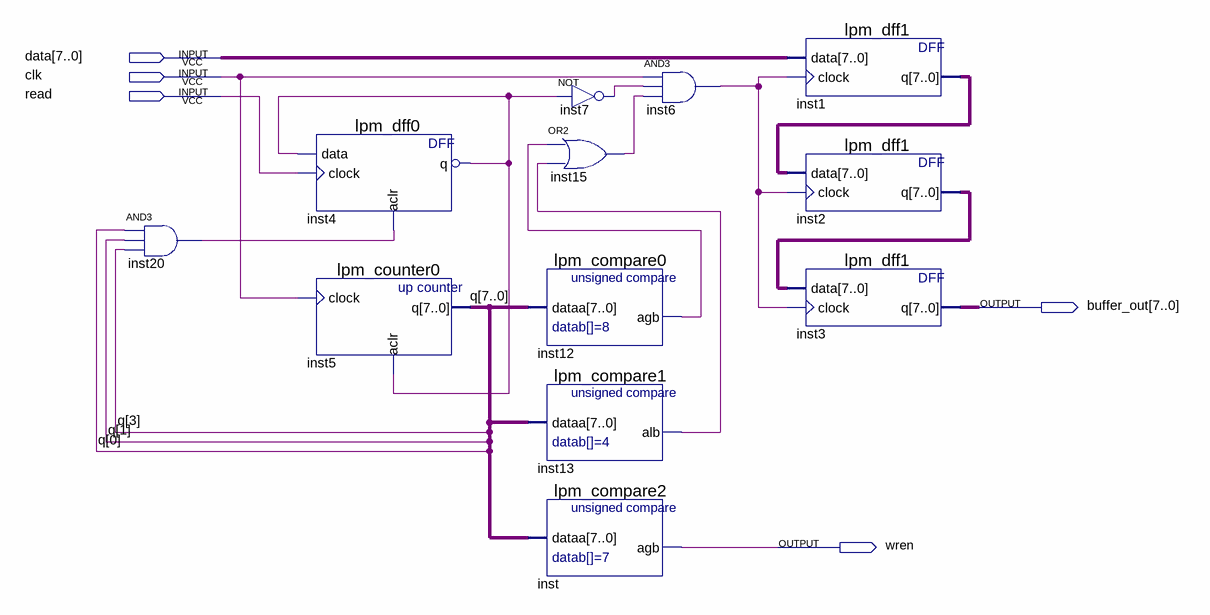
[diagram p0: schematic sheet]
// Quartus schematic buffer.bdf as structural Verilog: 12 symbols, 5 pins
module buffer (
  input  [7:0] data,
  input  clk,
  input  read,
  output [7:0] buffer_out,
  output wren
);

  wire inst4_q, inst4_q_inverted_out, inst6_out, inst7_out, inst12_agb, inst13_alb, inst15_out, inst20_out;
  wire [7:0] inst1_q, inst2_q, q;

  and inst20 (inst20_out, q[0], q[1], q[3]);
  lpm_dff0 inst4 (.data(inst4_q_inverted_out), .clock(read), .aclr(inst20_out), .q(inst4_q));
  not inst4_q_inverted (inst4_q_inverted_out, inst4_q);
  lpm_counter0 inst5 (.clock(clk), .aclr(inst4_q_inverted_out), .q(q));
  not inst7 (inst7_out, inst4_q_inverted_out);
  or inst15 (inst15_out, inst12_agb, inst13_alb);
  lpm_compare0 inst12 (.dataa(q), .agb(inst12_agb));
  lpm_compare1 inst13 (.dataa(q), .alb(inst13_alb));
  lpm_compare2 inst (.dataa(q), .agb(wren));
  and inst6 (inst6_out, clk, inst7_out, inst15_out);
  lpm_dff1 inst1 (.data(data), .clock(inst6_out), .q(inst1_q));
  lpm_dff1 inst2 (.data(inst1_q), .clock(inst6_out), .q(inst2_q));
  lpm_dff1 inst3 (.data(inst2_q), .clock(inst6_out), .q(buffer_out));
endmodule
